# EasyEDA Pro project 四路舵机降压板.epro, board PCB2
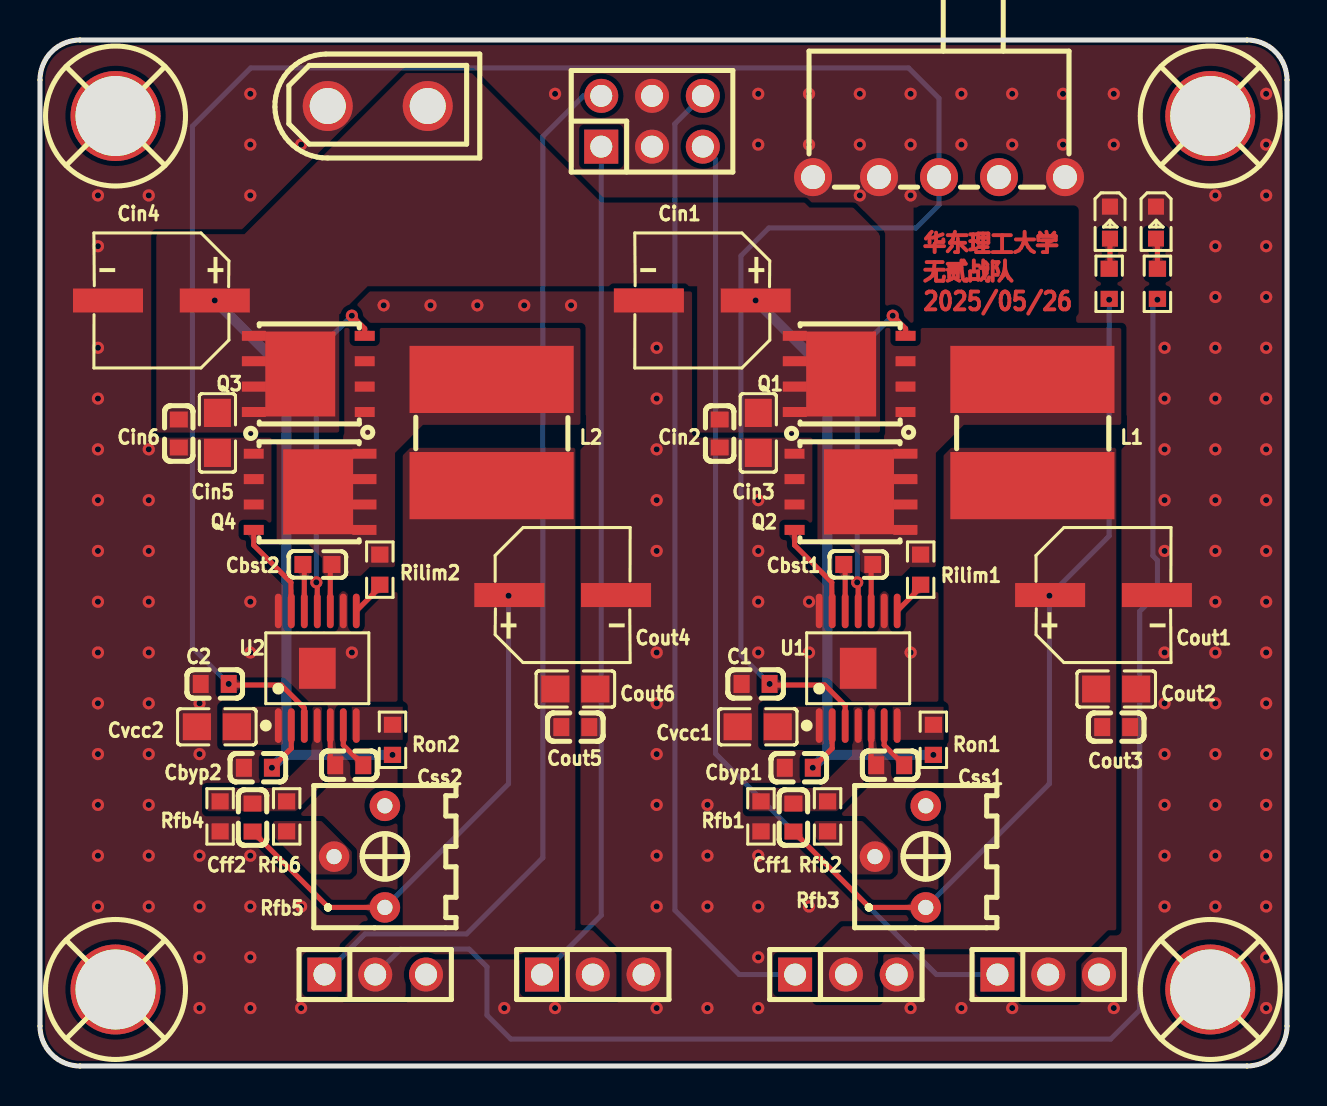
[diagram p7: board, top side]
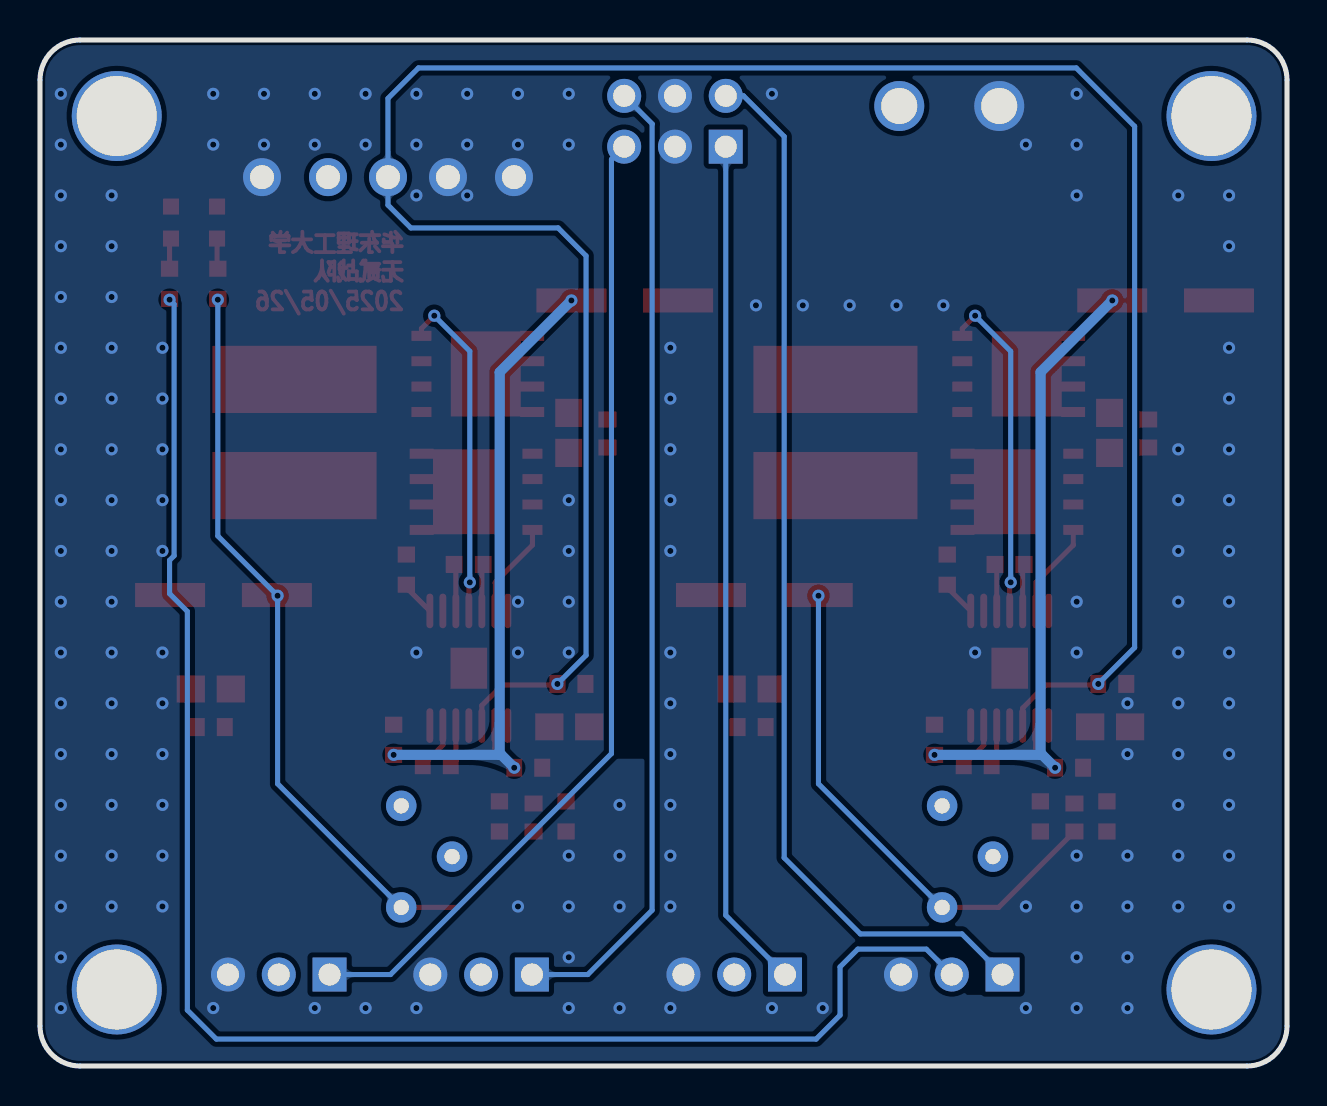
[diagram p8: board, bottom side, seen from below]

Outline 62.36 x 51.31 mm; copper layers: Top Layer, Bottom Layer. Coordinates in mm from the lower left corner of the outline.
Outline path: 0,49.31 0,2 arc(0.59,0.59) 2,0 60.36,0 arc(61.77,0.59) 62.36,2 62.36,49.31 arc(61.77,50.72) 60.36,51.31 2,51.31 arc(0.59,50.72) 0,49.31
Stack: Top Layer 0.035mm / Dielectric1 1.51mm FR4 er 4.5 / Bottom Layer 0.035mm

## Design rules (mm)
template: 自定义配置
spacing copperThickness1oz (default): track to track 0.102, other pairs 0.152 to 0.3
spacing copperThickness2oz: track to track 0.203, other pairs 0.152 to 0.3
track width copperThickness1oz (default): min 0.127, default 0.254, max 2.54
track width copperThickness2oz: min 0.203, default 0.254, max 2.54
differential pair differentialPair (default): width min 0.127, default 0.254, max 2.54; gap min 0.152, default 0.152
via viaSize (default): diameter min 0.5, default 0.61, max 10; hole min 0.3, default 0.305, max 6.3

## Placement (name value [footprint] x y rotation side)
C1  1nF  [C0603]  35.79 19.11 0 top
C2  1nF  [C0603]  8.74 19.11 0 top
Cbst1  470nF  [CAP-SMD_L1.6-W0.8-3]  40.92 25.08 180 top
Cbst2  470nF  [CAP-SMD_L1.6-W0.8-3]  13.87 25.08 180 top
Cbyp1  100nF  [C0603]  37.94 14.92 0 top
Cbyp2  100nF  [C0603]  10.9 14.92 0 top
Cff1  270pF  [C0603]  37.68 12.43 270 top
Cff2  270pF  [C0603]  10.63 12.43 270 top
Cin1  220uF  [CAP-SMD_BD6.3-L6.6-W6.6-LS7.4-FD]  33.12 38.28 180 top
Cin2  100nF  [C0603]  33.99 31.63 90 top
Cin3  10uF  [C0805]  35.92 31.66 90 top
Cin4  220uF  [CAP-SMD_BD6.3-L6.6-W6.6-LS7.4-FD]  6.07 38.28 180 top
Cin5  10uF  [C0805]  8.87 31.66 90 top
Cin6  100nF  [C0603]  6.94 31.63 90 top
CN2  XT30UPB-M  [CONN-TH_XT30UPB-M]  16.89 48.01 0 top
Cout1  220uF  [CAP-SMD_BD6.3-L6.6-W6.6-LS7.4-FD]  53.18 23.55 0 top
Cout2  10uF  [C0805]  53.82 18.85 180 top
Cout3  100nF  [C0603]  53.82 16.95 180 top
Cout4  220uF  [CAP-SMD_BD6.3-L6.6-W6.6-LS7.4-FD]  26.14 23.55 0 top
Cout5  100nF  [C0603]  26.77 16.95 180 top
Cout6  10uF  [C0805]  26.77 18.85 180 top
Css1  15nF  [C0603]  42.52 15.04 0 top
Css2  15nF  [C0603]  15.47 15.04 0 top
Cvcc1  2.2uF  [C0805]  35.89 16.96 0 top
Cvcc2  2.2uF  [C0805]  8.84 16.96 0 top
H2  PZ254V-11-03P  [HDR-TH_3P-P2.54-V-M]  16.76 4.57 0 top
H3  PZ254V-11-03P  [HDR-TH_3P-P2.54-V-M]  40.3 4.57 0 top
H4  PZ254V-11-03P  [HDR-TH_3P-P2.54-V-M]  27.64 4.57 0 top
H5  PZ254V-11-03P  [HDR-TH_3P-P2.54-V-M]  50.42 4.57 0 top
H6  PZ254V-12-6P  [HDR-TH_6P-P2.54-V-M-R2-C3-S2.54]  30.61 47.25 0 top
L1  3.3uH  [IND-SMD_L7.8-W7.6]  49.63 31.68 90 top
L2  3.3uH  [IND-SMD_L7.8-W7.6]  22.58 31.68 90 top
LED1  LTST-C190KSKT  [LED0603-RD]  55.81 42.18 270 top
LED2  LTST-C190KSKT  [LED0603-RD]  53.51 42.18 270 top
Q1  TPH1R403NL  [DSOP-8_L5.0-W5.0-P1.27-LS6.0-BL-EP]  40.51 34.61 90 top
Q2  TPH1R403NL  [DSOP-8_L5.0-W5.0-P1.27-LS6.0-BL-EP]  40.5 28.72 270 top
Q3  TPH1R403NL  [DSOP-8_L5.0-W5.0-P1.27-LS6.0-BL-EP]  13.47 34.61 90 top
Q4  TPH1R403NL  [DSOP-8_L5.0-W5.0-P1.27-LS6.0-BL-EP]  13.46 28.72 270 top
R1  10kΩ  [R0603]  55.88 39.12 270 top
R2  10kΩ  [R0603]  53.47 39.12 270 top
Rfb1  10kΩ  [R0603]  36.05 12.48 90 top
Rfb2  113kΩ  [R0603]  39.38 12.48 270 top
Rfb3  20kΩ  [RES-ADJ-TH_3362P]  43.02 10.47 90 top
Rfb4  10kΩ  [R0603]  9.01 12.48 90 top
Rfb5  20kΩ  [RES-ADJ-TH_3362P]  15.98 10.47 90 top
Rfb6  113kΩ  [R0603]  12.34 12.48 270 top
Rilim1  1.37kΩ  [R0603]  44.04 24.82 90 top
Rilim2  1.37kΩ  [R0603]  16.99 24.82 90 top
Ron1  267kΩ  [R0603]  44.68 16.31 90 top
Ron2  267kΩ  [R0603]  17.63 16.31 90 top
SCREW1  -  [M4螺丝]  3.78 47.51 0 top
SCREW2  -  [M4螺丝]  58.52 3.83 0 top
SCREW3  -  [M4螺丝]  58.52 47.51 0 top
SCREW4  -  [M4螺丝]  3.78 3.83 0 top
SW4  SS12F23G5  [SW-TH_SHOU-HAN_SS12F23G5]  44.96 44.45 0 top
U1  LM3150MHX/NOPB  [HTSSOP-14_L5.0-W4.4-P0.65-LS6.4-BL-EP]  40.91 19.89 0 top
U2  LM3150MHX/NOPB  [HTSSOP-14_L5.0-W4.4-P0.65-LS6.4-BL-EP]  13.87 19.89 0 top

## Footprints (pads in the part's own frame, mm; a bottom-side part is the same pattern mirrored in y, then rotated)
C0603
  rect 0.8x0.9 smd: 1(-0.7,0) 2(0.7,0)
C0805
  rect 1.41x1.35 smd: 1(-1,0) 2(1,0)
CAP-SMD_BD6.3-L6.6-W6.6-LS7.4-FD
  rect 3.5x1.2 smd: 1(-2.67,0) 2(2.67,0)
CAP-SMD_L1.6-W0.8-3
  rect 0.85x0.85 smd: 1(-0.725,0) 2(0.725,0)
CONN-TH_XT30UPB-M
  round 2.5 hole 1.8: 1(-2.5,0) 2(2.5,0)
DSOP-8_L5.0-W5.0-P1.27-LS6.0-BL-EP
  rect 0.5x1 smd: 1(-1.905,-2.77) 2(-0.635,-2.77) 3(0.634,-2.77) 4(1.905,-2.77)
  rect 0.5x1.2 smd: 5(1.905,2.77) 6(0.635,2.77) 7(-0.634,2.77) 8(-1.905,2.77)
  custom 4.25x3.5 smd: 9(0,0.45)
HDR-TH_3P-P2.54-V-M
  rect 1.7x1.7 hole 1.1: 1(-2.54,0)
  round 1.7 hole 1.1: 2(0,0) 3(2.54,0)
HDR-TH_6P-P2.54-V-M-R2-C3-S2.54
  rect 1.7x1.7 hole 1.1: 1(-2.54,-1.27)
  round 1.7 hole 1.1: 2(-2.54,1.27) 3(0,-1.27) 4(0,1.27) 5(2.54,-1.27) 6(2.54,1.27)
HTSSOP-14_L5.0-W4.4-P0.65-LS6.4-BL-EP
  oval 0.343x1.732 smd: 1(-1.95,-2.866) 2(-1.3,-2.866) 3(-0.65,-2.866) 4(0,-2.866) 5(0.65,-2.866) 6(1.3,-2.866) 7(1.95,-2.866) 8(1.95,2.866) 9(1.3,2.866) 10(0.65,2.866) 11(0,2.866) 12(-0.65,2.866) 13(-1.3,2.866) 14(-1.95,2.866)
  rect 1.83x2.055 smd: 15(0,0)
IND-SMD_L7.8-W7.6
  rect 3.36x8.208 smd: 1(2.655,0) 2(-2.655,0)
LED0603-RD
  rect 0.8x0.8 smd: 1(-0.799,0) 2(0.799,0)
M4螺丝
  round 4.5 hole 4: 1(0,0)
R0603
  rect 0.806x0.864 smd: 1(-0.753,0) 2(0.753,0)
RES-ADJ-TH_3362P
  round 1.524 hole 0.762: 1(-2.54,-1.27) 2(0,1.27) 3(2.54,-1.27)
SW-TH_SHOU-HAN_SS12F23G5
  round 1.9 hole 1.2: 1(-3,0) 2(0,0) 3(3,0) 4(6.3,0) 5(-6.3,0)

## Nets
7.4V_1: Cff2.2 Cout4.1 Cout5.2 Cout6.2 H2.2 H4.2 L2.2 R1.2 Rfb5.1
7.4V_2: Cff1.2 Cout1.1 Cout2.2 Cout3.2 H3.2 H5.2 L1.2 R2.2 Rfb3.1
GND: C1.1 C2.1 Cbyp1.1 Cbyp2.1 Cin1.2 Cin2.1 Cin3.1 Cin4.2 Cin5.1 Cin6.1 CN2.1 Cout1.2 Cout2.1 Cout3.1 Cout4.2 Cout5.1 Cout6.1 Css1.1 Css2.1 Cvcc1.1 Cvcc2.1 H2.3 H3.3 H4.3 H5.3 H6.3 H6.4 LED1.1 LED2.1 Q2.1 Q2.2 Q2.3 Q4.1 Q4.2 Q4.3 Rfb1.1 Rfb4.1 SW4.1 SW4.4 SW4.5 U1.5 U1.9 U1.14 U1.15 U2.5 U2.9 U2.14 U2.15
VIN: Cbyp1.2 Cbyp2.2 Cin1.1 Cin2.2 Cin3.2 Cin4.1 Cin5.2 Cin6.2 CN2.2 Q1.5 Q1.6 Q1.7 Q1.8 Q1.9 Q3.5 Q3.6 Q3.7 Q3.8 Q3.9 Ron1.1 Ron2.1 U1.2 U2.2
$1I7673\$1N1099: Css1.2 U1.6
$1I7673\$1N1101: Cvcc1.2 U1.1
$1I7673\$1N1102: Ron1.2 U1.7
$1I7673\$1N1104: Q1.4 U1.11
$1I7673\$1N1105: Cbst1.2 U1.12
$1I7673\$1N1106: Rilim1.1 U1.8
$1I7673\$1N1119: Cbst1.1 L1.1 Q1.1 Q1.2 Q1.3 Q2.5 Q2.6 Q2.7 Q2.8 Q2.9 Rilim1.2 U1.10
$1I7673\$1N1128: Rfb2.2 Rfb3.2
$1I7673\FB_1: Cff1.1 Rfb1.2 Rfb2.1 U1.4
$1I7673\LG_1: Q2.4 U1.13
$1I7695\$1N1099: Css2.2 U2.6
$1I7695\$1N1101: Cvcc2.2 U2.1
$1I7695\$1N1102: Ron2.2 U2.7
$1I7695\$1N1104: Q3.4 U2.11
$1I7695\$1N1105: Cbst2.2 U2.12
$1I7695\$1N1106: Rilim2.1 U2.8
$1I7695\$1N1119: Cbst2.1 L2.1 Q3.1 Q3.2 Q3.3 Q4.5 Q4.6 Q4.7 Q4.8 Q4.9 Rilim2.2 U2.10
$1I7695\$1N1128: Rfb5.2 Rfb6.2
$1I7695\FB_1: Cff2.1 Rfb4.2 Rfb6.1 U2.4
$1I7695\LG_1: Q4.4 U2.13
EN: C1.2 C2.2 SW4.2 U1.3 U2.3
PWM1: H2.1 H6.2
PWM2: H4.1 H6.1
PWM3: H3.1 H6.6
PWM4: H5.1 H6.5
$1N8148: LED1.2 R1.1
$1N8161: LED2.2 R2.1

Pads without a net: Rfb3 3; Rfb5 3; SCREW1 1; SCREW2 1; SCREW3 1; SCREW4 1; SW4 3

## Via types
v1: diameter 0.61, hole 0.305, Top Layer to Bottom Layer, 163 vias

## Routing (per net, layer and track width the routed paths; a pad name or vN(x,y) marks a point on that pad's centre or on a via; arc(x,y) is an arc through that point)
7.4V_1: length 105.1
  Top Layer w0.254: Cff2.2 14.42,7.93 Rfb5.1
  Bottom Layer w0.254: H2.2 18.03,5.84 21.46,5.84 22.35,4.95 22.35,2.54 23.55,1.35 53.54,1.35 54.99,2.8 54.99,22.73 55.88,23.62 55.88,25.29 55.65,25.52 55.65,38.1 v1(55.88,38.32) ; v1(23.43,23.52) 23.43,14.12 Rfb5.1
7.4V_2: length 42.4
  Top Layer w0.254: Rfb3.1 41.47,7.93 Cff1.2
  Bottom Layer w0.254: Rfb3.1 50.48,14.12 v1(50.48,23.52) 53.47,26.51 v1(53.47,38.32)
GND: length 4.2
  Top Layer w0.254: U1.5 41.56,15.3 Css1.1 ; Css2.1 14.52,15.3 U2.5
  vias: v1(2.9,43.54) v1(2.9,41) v1(2.9,35.92) v1(2.9,33.38) v1(2.9,30.84) v1(2.9,28.3) v1(2.9,25.76) v1(2.9,23.22) v1(2.9,20.68) v1(2.9,18.14) v1(2.9,15.6) v1(2.9,13.06) v1(2.9,10.52) v1(2.9,7.98) v1(5.44,43.54) v1(5.44,30.84) v1(5.44,28.3) v1(5.44,25.76) v1(5.44,23.22) v1(5.44,20.68) v1(5.44,18.14) v1(5.44,15.6) v1(5.44,13.06) v1(5.44,10.52) v1(5.44,7.98) v1(7.98,18.14) v1(7.98,15.6) v1(7.98,10.52) v1(7.98,7.98) v1(7.98,5.44) v1(7.98,2.9) v1(10.52,48.62) v1(10.52,46.08) v1(10.52,43.54) v1(10.52,23.22) v1(10.52,20.68) v1(10.52,10.52) v1(10.52,7.98) v1(10.52,5.44) v1(10.52,2.9) v1(13.06,46.08) v1(13.06,7.98) v1(13.06,2.9) v1(15.6,20.68) v1(17.19,38.04) v1(19.53,38.04) v1(21.87,38.04) v1(23.22,2.9) v1(24.21,38.04) v1(25.76,48.62) v1(25.76,2.9) v1(26.56,38.04) v1(30.84,35.92) v1(30.84,33.38) v1(30.84,30.84) v1(30.84,28.3) v1(30.84,25.76) v1(30.84,20.68) v1(30.84,18.14) v1(30.84,15.6) v1(30.84,13.06) v1(30.84,10.52) v1(30.84,7.98) v1(30.84,2.9) v1(33.38,13.06) v1(33.38,10.52) v1(33.38,7.98) v1(33.38,2.9) v1(35.92,48.62) v1(35.92,46.08) v1(35.92,28.3) v1(35.92,25.76) v1(35.92,23.22) v1(35.92,20.68) v1(35.92,10.52) v1(35.92,7.98) v1(35.92,5.44) v1(35.92,2.9) v1(38.46,48.62) v1(38.46,46.08) v1(38.46,23.22) v1(38.46,20.68) v1(38.46,7.98) v1(41,48.62) v1(41,46.08) v1(41,43.54) v1(43.54,48.62) v1(43.54,46.08) v1(43.54,43.54) v1(43.54,20.68) v1(43.54,2.9) v1(46.08,48.62) v1(46.08,46.08) v1(46.08,2.9) v1(48.62,48.62) v1(48.62,46.08) v1(48.62,2.9) v1(51.16,48.62) v1(51.16,46.08) v1(53.7,48.62) v1(53.7,46.08) v1(53.7,2.9) v1(56.24,35.92) v1(56.24,33.38) v1(56.24,30.84) v1(56.24,28.3) v1(56.24,25.76) v1(56.24,20.68) v1(56.24,18.14) v1(56.24,15.6) v1(56.24,13.06) v1(56.24,10.52) v1(56.24,7.98) v1(58.78,43.54) v1(58.78,41) v1(58.78,38.46) v1(58.78,35.92) v1(58.78,33.38) v1(58.78,30.84) v1(58.78,28.3) v1(58.78,25.76) v1(58.78,23.22) v1(58.78,20.68) v1(58.78,18.14) v1(58.78,15.6) v1(58.78,13.06) v1(58.78,10.52) v1(58.78,7.98) v1(61.32,48.62) v1(61.32,46.08) v1(61.32,43.54) v1(61.32,41) v1(61.32,38.46) v1(61.32,35.92) v1(61.32,33.38) v1(61.32,30.84) v1(61.32,28.3) v1(61.32,25.76) v1(61.32,23.22) v1(61.32,20.68) v1(61.32,18.14) v1(61.32,15.6) v1(61.32,13.06) v1(61.32,10.52) v1(61.32,7.98) v1(61.32,5.44) v1(61.32,2.9)
VIN: length 66
  Top Layer w0.254: 39.62,17.03 39.62,15.89 v1(38.65,14.92) ; 12.57,17.03 12.57,15.89 v1(11.6,14.92)
  Bottom Layer w0.508: v1(11.6,14.92) 12.24,15.56 12.32,15.56 ; 39.37,15.56 39.29,15.56 v1(38.65,14.92) ; 39.37,15.56 v1(44.68,15.56) ; 39.37,15.56 39.37,34.7 v1(35.79,38.28) ; v1(8.74,38.28) 12.32,34.7 12.32,15.56 ; 12.32,15.56 v1(17.63,15.56)
$1I7673\$1N1099: length 2.4
  Top Layer w0.254: Css1.2 42.22,16.05 U1.6
$1I7673\$1N1104: length 16.8
  Top Layer w0.254: U1.11 40.91,24.14 40.89,24.17 ; v1(42.64,37.52) 43.28,36.88 Q1.4
  Bottom Layer w0.254: v1(42.64,37.52) 40.87,35.74 v1(40.87,24.19)
$1I7673\$1N1105: length 2.4
  Top Layer w0.254: Cbst1.2 40.26,25.01 U1.12
$1I7673\$1N1106: length 1.8
  Top Layer w0.254: Rilim1.1 44.04,23.93 U1.8
$1I7673\$1N1119: length 2.4
  Top Layer w0.254: U1.10 41.56,25 Cbst1.1
$1I7673\LG_1: length 4.8
  Top Layer w0.254: 39.62,22.76 39.6,22.78 39.6,24.19 37.74,26.05 37.74,26.81
$1I7695\$1N1099: length 2.4
  Top Layer w0.254: Css2.2 15.17,16.05 U2.6
$1I7695\$1N1104: length 16.8
  Top Layer w0.254: 13.84,24.17 13.87,24.14 U2.11 ; 16.24,36.52 16.24,36.88 v1(15.6,37.52)
  Bottom Layer w0.254: v1(13.82,24.19) 13.82,35.74 v1(15.6,37.52)
$1I7695\$1N1105: length 2.4
  Top Layer w0.254: U2.12 13.22,25.01 Cbst2.2
$1I7695\$1N1106: length 1.8
  Top Layer w0.254: Rilim2.1 16.99,23.93 U2.8
$1I7695\$1N1119: length 2.4
  Top Layer w0.254: 14.6,25.08 14.52,25 U2.10
$1I7695\LG_1: length 4.8
  Top Layer w0.254: Q4.4 10.69,26.05 12.55,24.19 12.55,22.78 12.57,22.76
EN: length 116.5
  Top Layer w0.254: U1.3 40.26,18.03 39.24,19.05 36.54,19.05 v1(36.49,19.11) ; U2.3 13.22,17.9 12.06,19.05 9.49,19.05 v1(9.44,19.11)
  Bottom Layer w0.254: v1(36.49,19.11) 35.05,20.54 35.05,40.52 36.45,41.91 43.81,41.91 44.96,43.06 SW4.2 44.96,48.39 43.43,49.91 10.54,49.91 7.62,46.99 7.62,20.92 v1(9.44,19.11)
PWM1: length 53.2
  Bottom Layer w0.254: H2.1 16.26,6.61 21.34,6.61 25.15,10.42 25.15,46.48 27.18,48.52 H6.2
PWM2: length 42.6
  Bottom Layer w0.254: H6.1 28.07,7.54 H4.1
PWM3: length 48.7
  Bottom Layer w0.254: H3.1 34.97,4.57 31.75,7.79 31.75,47.11 ; H6.6 31.74,47.11
PWM4: length 49.3
  Bottom Layer w0.254: H6.5 33.78,45.34 33.78,15.62 44.83,4.57 H5.1
$1N8148: length 1.5
  Top Layer w0.254: LED1.2 55.88,41.31 R1.1
$1N8161: length 1.5
  Top Layer w0.254: LED2.2 53.51,39.91 R2.1

## Copper pours and planes (outline as drawn; the poured copper is in the pictures)
7.4V_1 on Top Layer: 15.24,3.43 15.24,5.97 16.26,6.99 26.57,6.99 26.77,6.79 27.63,6.79 28.83,5.59 28.83,3.43 26.42,3.43 26.42,5.08 25.91,5.59 18.92,5.59 18.29,4.95 18.29,3.43
7.4V_1 on Top Layer: 26.77,30.92 18.52,30.92 18.14,30.54 18.14,6.79 26.77,6.79
7.4V_2 on Top Layer: 53.82,30.92 45.56,30.92 45.18,30.54 45.18,6.79 53.82,6.79
7.4V_2 on Top Layer: 38.86,3.3 38.86,5.72 40.13,6.99 53.72,6.99 53.82,6.89 53.82,6.79 53.4,6.79 51.82,5.21 51.82,3.3 49.15,3.3 49.15,5.34 48.64,5.84 42.04,5.84 41.91,5.72 41.91,3.3
GND on Top Layer: -2.54,54.23 65.02,54.23 65.02,-2.54 -2.54,-2.54
GND on Bottom Layer: -5.72,56.64 68.07,56.64 68.07,-5.71 -5.72,-5.71
VIN on Top Layer: 32.86,41.59 42.01,41.59 42.01,31.68 32.86,31.68
VIN on Top Layer: 5.82,41.59 10.22,41.59 18.29,49.66 21.59,49.66 28.07,43.18 38.23,43.18 38.48,42.93 40.67,42.93 42.01,41.59 39.41,38.99 16.38,38.99 14.99,37.59 9.81,37.59
VIN on Top Layer: 5.82,41.59 14.96,41.59 14.96,31.68 5.82,31.68
$1I7673\$1N1101 on Top Layer: 36.17,17.96 39.21,17.96 39.21,16.06 36.17,16.06
$1I7673\$1N1102 on Top Layer: 42.64,17.96 45.18,17.96 45.18,16.31 42.64,16.31
$1I7673\$1N1119 on Top Layer: 42.21,36.91 54.07,36.91 54.07,32.06 46.2,32.06 44.8,30.66 44.8,24.95 43.53,24.95 42.39,26.09 39,26.09 38.88,26.22 38.88,31.22 42.21,31.22
$1I7673\$1N1119 on Top Layer: 39.62,26.16 40.39,26.16 41.02,25.53 41.02,24.64 41.15,24.51 43.1,24.51 43.53,24.95 43.53,26.19 43.31,26.42 39.88,26.42
$1I7673\$1N1128 on Top Layer: 38.71,12.25 41.12,12.25 42.64,10.73 42.64,9.71 42.52,9.58 40.61,9.58 38.71,11.49
$1I7673\FB_1 on Top Layer: 40.61,17.96 40.61,15.55 38.96,13.9 35.4,13.9 35.4,12.74 39.84,12.74 41.18,14.09 41.18,17.97 40.62,17.97
$1I7695\$1N1101 on Top Layer: 9.12,17.96 12.17,17.96 12.17,16.06 9.12,16.06
$1I7695\$1N1102 on Top Layer: 15.6,17.96 18.14,17.96 18.14,16.31 15.6,16.31
$1I7695\$1N1119 on Top Layer: 15.16,36.91 27.03,36.91 27.03,32.06 19.15,32.06 17.75,30.66 17.75,24.95 16.49,24.95 15.34,26.09 11.96,26.09 11.83,26.22 11.83,31.22 15.16,31.22
$1I7695\$1N1119 on Top Layer: 15.88,26.29 13.21,26.29 14.1,25.4 14.1,24.51 16.05,24.51 16.49,24.95 16.49,25.68
$1I7695\$1N1128 on Top Layer: 11.66,12.25 14.07,12.25 15.6,10.73 15.6,9.71 15.47,9.58 13.56,9.58 11.66,11.49
$1I7695\FB_1 on Top Layer: 13.56,17.96 13.56,15.55 11.91,13.9 8.36,13.9 8.36,12.74 12.79,12.74 14.13,14.09 14.13,17.97 13.57,17.97

Small or netless copper shapes (teardrops, artwork), in the pictures only: 50 on Top Layer, 32 on Bottom Layer

## Text on the board
Top Layer: 华东理工大学 / 无贰战队 / 2025/05/26
